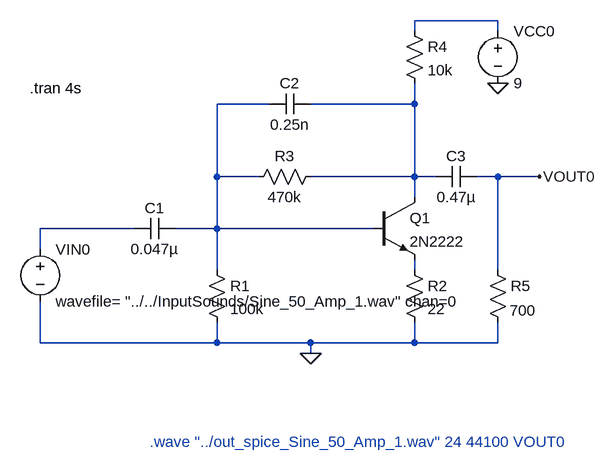
[diagram p0: schematic CommonEmitterAmplifier.asc]
CommonEmitterAmplifier.asc, the LTspice schematic file:
Version 4
SHEET 1 3112 776
WIRE 656 112 528 112
WIRE 528 128 528 112
WIRE 656 128 656 112
WIRE 304 240 224 240
WIRE 528 240 528 208
WIRE 528 240 368 240
WIRE 224 352 224 240
WIRE 288 352 224 352
WIRE 528 352 528 240
WIRE 528 352 368 352
WIRE 560 352 528 352
WIRE 656 352 624 352
WIRE 720 352 656 352
WIRE 528 384 528 352
WIRE 96 432 -48 432
WIRE 224 432 224 352
WIRE 224 432 160 432
WIRE 464 432 224 432
WIRE -48 464 -48 432
WIRE 224 496 224 432
WIRE 528 496 528 480
WIRE 656 496 656 352
WIRE -48 608 -48 544
WIRE 224 608 224 576
WIRE 224 608 -48 608
WIRE 368 608 224 608
WIRE 528 608 528 576
WIRE 528 608 368 608
WIRE 656 608 656 576
WIRE 656 608 528 608
WIRE 368 624 368 608
FLAG 368 624 0
FLAG 656 208 0
FLAG 720 352 VOUT0
SYMBOL /voltage -48 448 R0
SYMATTR InstName VIN0
SYMATTR Value wavefile= "../../InputSounds/Sine_50_Amp_1.wav" chan=0
SYMBOL /voltage 656 112 R0
SYMATTR InstName VCC0
SYMATTR Value 9
SYMBOL /cap 160 416 R90
WINDOW 0 0 32 VBottom 2
WINDOW 3 32 32 VTop 2
SYMATTR InstName C1
SYMATTR Value 0.047µ
SYMBOL /cap 304 256 R270
WINDOW 0 32 32 VTop 2
WINDOW 3 0 32 VBottom 2
SYMATTR InstName C2
SYMATTR Value 0.25n
SYMBOL /cap 560 368 R270
WINDOW 0 32 32 VTop 2
WINDOW 3 0 32 VBottom 2
SYMATTR InstName C3
SYMATTR Value 0.47µ
SYMBOL /res 208 480 R0
SYMATTR InstName R1
SYMATTR Value 100k
SYMBOL /res 512 480 R0
SYMATTR InstName R2
SYMATTR Value 22
SYMBOL /res 384 336 R90
WINDOW 0 0 56 VBottom 2
WINDOW 3 32 56 VTop 2
SYMATTR InstName R3
SYMATTR Value 470k
SYMBOL /res 512 112 R0
SYMATTR InstName R4
SYMATTR Value 10k
SYMBOL /res 640 480 R0
WINDOW 3 34 78 Left 2
SYMATTR Value 700
SYMATTR InstName R5
SYMBOL /npn 464 384 R0
SYMATTR InstName Q1
SYMATTR Value 2N2222
TEXT -64 216 Left 2 !.tran 4s
TEXT 120 760 Left 2 ;.wave "../out_spice_Sine_50_Amp_1.wav" 24 44100 VOUT0

The netlist it stands for:
* CommonEmitterAmplifier.asc
VIN0 N004 0 wavefile= "../../InputSounds/Sine_50_Amp_1.wav" chan=0
VCC0 N001 0 9
C1 N002 N004 0.047µ
C2 N002 N003 0.25n
C3 N003 VOUT0 0.47µ
R1 N002 0 100k
R2 N005 0 22
R3 N003 N002 470k
R4 N001 N003 10k
R5 VOUT0 0 700
Q1 N003 N002 N005 0 2N2222
.model NPN NPN
.model PNP PNP
.lib standard.bjt
.tran 4s
* .wave "../out_spice_Sine_50_Amp_1.wav" 24 44100 VOUT0
.backanno
.end